# Altium schematic sheet 16B Sata Connectors.SchDoc
size 420 x 297 mm
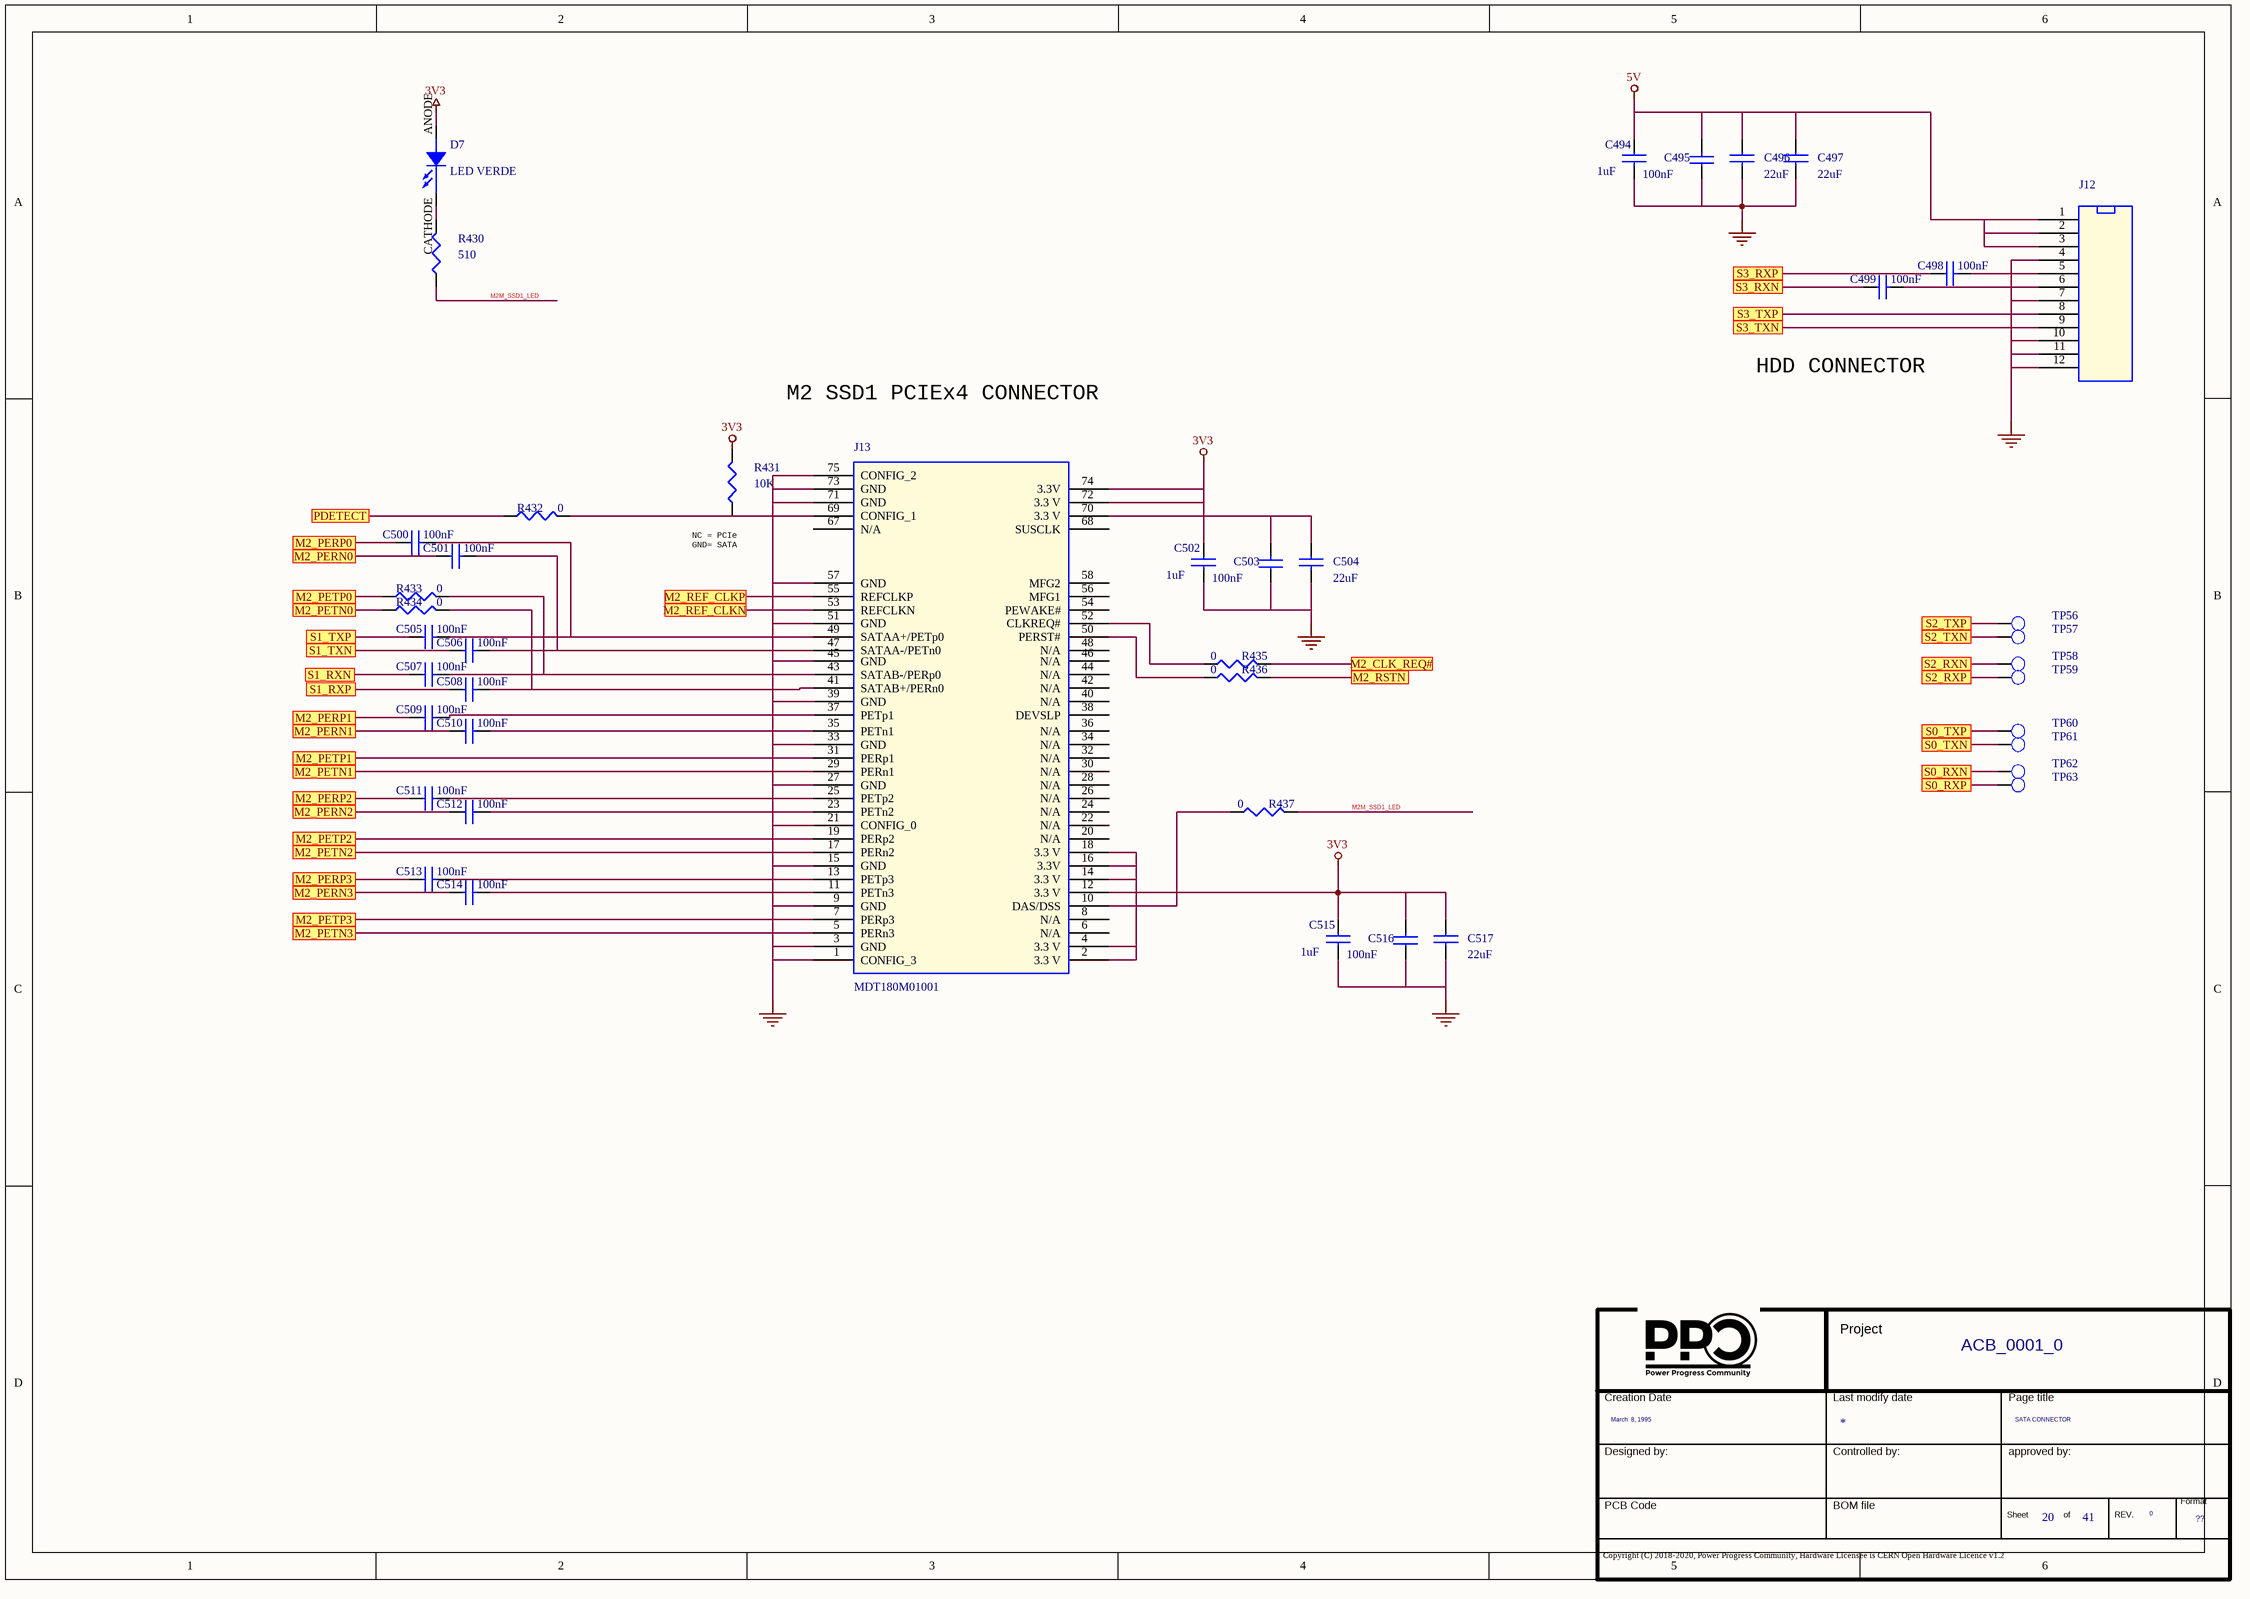
[diagram p0: 16B Sata Connectors.SchDoc]

## Parts
*  Page Count: 41  Page Create Date: March  8, 1995  Page Number: 20  Page Size: ??  Page Title: SATA CONNECTOR  RevCode: 0  Title: ACB_0001_0  (hidden comment: Title_block_PPC)  (graphical)
C494  1uF  [SMD_0402]
C495  100nF  [SMD_0402]
C496  22uF  [SMD_0805]
C497  22uF  [SMD_0805]
C498  100nF  [SMD_0402]
C499  100nF  [SMD_0402]
C500  100nF  [SMD_0402]
C501  100nF  [SMD_0402]
C502  1uF  [SMD_0402]
C503  100nF  [SMD_0402]
C504  22uF  [SMD_0805]
C505  100nF  [SMD_0402]
C506  100nF  [SMD_0402]
C507  100nF  [SMD_0402]
C508  100nF  [SMD_0402]
C509  100nF  [SMD_0402]
C510  100nF  [SMD_0402]
C511  100nF  [SMD_0402]
C512  100nF  [SMD_0402]
C513  100nF  [SMD_0402]
C514  100nF  [SMD_0402]
C515  1uF  [SMD_0402]
C516  100nF  [SMD_0402]
C517  22uF  [SMD_0805]
D7  LED VERDE  [led_0603]
J12  MCV 1,5/12-G-3,5  [SMD_2X50_P=0.635mm]  (value not drawn)
J13  MDT180M01001  [67 PIN PASSO 0.5mm]
R430  510  [SMD_0402]
R431  10K  [SMD_0402]
R432  0  [SMD_0402]
R433  0  [SMD_0402]
R434  0  [SMD_0402]
R435  0  [SMD_0402]
R436  0  [SMD_0402]
R437  0  [SMD_0402]
TP56  TEST POINT  [PCB]  (value not drawn)
TP57  TEST POINT  [PCB]  (value not drawn)
TP58  TEST POINT  [PCB]  (value not drawn)
TP59  TEST POINT  [PCB]  (value not drawn)
TP60  TEST POINT  [PCB]  (value not drawn)
TP61  TEST POINT  [PCB]  (value not drawn)
TP62  TEST POINT  [PCB]  (value not drawn)
TP63  TEST POINT  [PCB]  (value not drawn)

## Ports
M2_CLK_REQ#, M2_PERN0, M2_PERN1, M2_PERN2, M2_PERN3, M2_PERP0, M2_PERP1, M2_PERP2, M2_PERP3, M2_PETN0, M2_PETN1, M2_PETN2, M2_PETN3, M2_PETP0, M2_PETP1, M2_PETP2, M2_PETP3, M2_REF_CLKN, M2_REF_CLKP, M2_RSTN, PDETECT, S0_RXN, S0_RXP, S0_TXN, S0_TXP, S1_RXN, S1_RXP, S1_TXN, S1_TXP, S2_RXN, S2_RXP, S2_TXN, S2_TXP, S3_RXN, S3_RXP, S3_TXN, S3_TXP

## Nets
3V3: C502.1 C503.2 C504.1 C515.1 C516.2 C517.1 D7.ANODE J13.2(3.3_V) J13.4(3.3_V) J13.12(3.3_V) J13.14(3.3_V) J13.16(3.3V) J13.18(3.3_V) J13.70(3.3_V) J13.72(3.3_V) J13.74(3.3V) R431.1
5V: C494.1 C495.2 C496.1 C497.1 J12.1 J12.2 J12.3
GND: C494.2 C495.1 C496.2 C497.2 C502.2 C503.1 C504.2 C515.2 C516.1 C517.2 J12.4 J12.7 J12.10 J12.11 J12.12 J13.1(CONFIG_3) J13.3(GND) J13.9(GND) J13.15(GND) J13.21(CONFIG_0) J13.27(GND) J13.33(GND) J13.39(GND) J13.45(GND) J13.51(GND) J13.57(GND) J13.71(GND) J13.73(GND) J13.75(CONFIG_2)
M2_CLK_REQ#: R435.1 ; port M2_CLK_REQ#
M2_PERN0: C501.1 ; port M2_PERN0
M2_PERN1: C510.1 ; port M2_PERN1
M2_PERN2: C512.1 ; port M2_PERN2
M2_PERN3: C514.1 ; port M2_PERN3
M2_PERP0: C500.1 ; port M2_PERP0
M2_PERP1: C509.1 ; port M2_PERP1
M2_PERP2: C511.1 ; port M2_PERP2
M2_PERP3: C513.1 ; port M2_PERP3
M2_PETN0: R434.1 ; port M2_PETN0
M2_PETN1: J13.29(PERn1) ; port M2_PETN1
M2_PETN2: J13.17(PERn2) ; port M2_PETN2
M2_PETN3: J13.5(PERn3) ; port M2_PETN3
M2_PETP0: R433.1 ; port M2_PETP0
M2_PETP1: J13.31(PERp1) ; port M2_PETP1
M2_PETP2: J13.19(PERp2) ; port M2_PETP2
M2_PETP3: J13.7(PERp3) ; port M2_PETP3
M2_REF_CLKN: J13.53(REFCLKN) ; port M2_REF_CLKN
M2_REF_CLKP: J13.55(REFCLKP) ; port M2_REF_CLKP
M2_RSTN: R436.1 ; port M2_RSTN
M2M_SSD1_LED: R430.1 R437.1
PDETECT: R432.1 ; port PDETECT
S0_RXN: TP62.1(TP) ; port S0_RXN
S0_RXP: TP63.1(TP) ; port S0_RXP
S0_TXN: TP61.1(TP) ; port S0_TXN
S0_TXP: TP60.1(TP) ; port S0_TXP
S1_RXN: C507.1 ; port S1_RXN
S1_RXP: C508.1 ; port S1_RXP
S1_TXN: C506.1 ; port S1_TXN
S1_TXP: C505.1 ; port S1_TXP
S2_RXN: TP58.1(TP) ; port S2_RXN
S2_RXP: TP59.1(TP) ; port S2_RXP
S2_TXN: TP57.1(TP) ; port S2_TXN
S2_TXP: TP56.1(TP) ; port S2_TXP
S3_RXN: C499.1 ; port S3_RXN
S3_RXP: C498.1 ; port S3_RXP
S3_TXN: J12.9 ; port S3_TXN
S3_TXP: J12.8 ; port S3_TXP
NetC498_2: C498.2 J12.5
NetC499_2: C499.2 J12.6
NetC500_2: C500.2 C505.2 J13.49(SATAA+/PETp0)
NetC501_2: C501.2 C506.2 J13.47(SATAA-/PETn0)
NetC507_2: C507.2 J13.43(SATAB-/PERp0) R433.2
NetC508_2: C508.2 J13.41(SATAB+/PERn0) R434.2
NetC509_2: C509.2 J13.37(PETp1)
NetC510_2: C510.2 J13.35(PETn1)
NetC511_2: C511.2 J13.25(PETp2)
NetC512_2: C512.2 J13.23(PETn2)
NetC513_2: C513.2 J13.13(PETp3)
NetC514_2: C514.2 J13.11(PETn3)
NetD7_CATHODE: D7.CATHODE R430.2
NetJ13_10: J13.10(DAS/DSS) R437.2
NetJ13_50: J13.50(PERST#) R436.2
NetJ13_52: J13.52(CLKREQ#) R435.2
NetJ13_69: J13.69(CONFIG_1) R431.2 R432.2

Not connected (* = marked no-connect by the designer): J13 6(N/A) 8(N/A) 20(N/A) 22(N/A) 24(N/A) 26(N/A) 28(N/A) 30(N/A) 32(N/A) 34(N/A) 36(N/A) 38(DEVSLP) 40(N/A) 42(N/A) 44(N/A) 46(N/A) 48(N/A) 54(PEWAKE#) 56(MFG1) 58(MFG2) 67(N/A) 68(SUSCLK)

## Notes on the sheet
- HDD CONNECTOR
- M2 SSD1 PCIEx4 CONNECTOR
- (near R431) NC = PCIe
  GND= SATA
- (in symbol Title_block_PPC) Project; Creation Date; Last modify date; Page title; Designed by:; Controlled by:; approved by:; Format; PCB Code; BOM file; Sheet; of; REV.; Copyright (C) 2018-2020, Power Progress Community, Hardware Licensee is CERN Open Hardware Licence v1.2

## Library data of the parts
* = Title_block_PPC: Schematic Page Count: 45; Schematic Page Number: 22; Page Modify Date: *
C494 = CAP NP_Dup9: CAP CER 1UF 6.3V 10% X5R 0402 AUTOMOTIVE; Part Number: PASSIVE_49; Manufacturer 1: Taiyo Yuden; Manufacturer Part Number 1: JMK105BJ105KVHF; RSM: RC0402; PCB Footprint: SMD_0402; Part Type: Capacitors\Ceramic\SMD\0402; Distributor 1: DIGIKEY (587-3766-1-ND)
C495 C501 C506 C507 C510 C512 C514 = CAP NP_Dup9: COND.CER. 100NF 50V 0402 X7R SMD; Manufacturer Part Number 1: CGA2B3X7R1H104M050BD; Manufacturer 1: TDK; Part Number: PASSIVE_24; RSM: RC0402; PCB Footprint: SMD_0402; Distributor 1: MURATA ELETTRONICA SPA; Part Type: Capacitors\Ceramic\SMD\0402
C496 C497 C504 C517 = CAP NP_Dup2: 22UF 35V 20% 0805; Part Number: PASSIVE_224; Manufacturer 1: TDK; Manufacturer Part Number 1: C2012X5R1V226M125AC; RSM: RC0805; Part Type: Capacitors\Ceramic\SMD\0805; PCB Footprint: SMD_0805
C498-C500 C503 C505 C508 C509 C511 C513 C516 = CAP NP_Dup9: COND.CER. 100NF 50V 0402 X7R SMD; Part Number: PASSIVE_24; Manufacturer 1: TDK; Manufacturer Part Number 1: CGA2B3X7R1H104M050BD; RSM: RC0402; PCB Footprint: SMD_0402; Part Type: Capacitors\Ceramic\SMD\0402; Distributor 1: MURATA ELETTRONICA SPA
C502 C515 = CAP NP_Dup9: CAP CER 1UF 6.3V 10% X5R 0402 AUTOMOTIVE; Manufacturer Part Number 1: JMK105BJ105KVHF; Manufacturer 1: Taiyo Yuden; Part Number: PASSIVE_49; RSM: RC0402; Distributor 1: DIGIKEY (587-3766-1-ND); Part Type: Capacitors\Ceramic\SMD\0402; PCB Footprint: SMD_0402
D7 = LED_1: LED CHIPLED VERDE 40mcd 570nm; Manufacturer Part Number 1: 598-8070-107F; Manufacturer 1: DIALIGHT; Part Number: DISCRETE_31; PCB Footprint: SMD_0603; RSM: LED0603-AK; Distributor 1: MOUSER(645-598-8070-107F); Part Type: Diodes\LED; TYPE: LED
J12 = HEADER_12X1_Dup1: 12X1 3.5; PART NUMBER: CONNECTORS_31; Manufacturer 1: PHOENIX; RSM: PHOE-MCV-12-3_5; PCB Footprint: 12X1 3.5; Distributor 1: Samtec; Manufacturer Part Number 1: MCV 1,5/12-G-3,5; Part Type: B2W
J13 = M2_M_KEY: Connettori PCI Express/PCI 67P SMT RCPT H1.8 M Key; Manufacturer 1: AMPHENOL; Part Number: CONNECTORS_682; RSM: FCI-MDT180M01001; PCB Footprint: 67 PIN PASSO 0.5mm; Distributor 1: MOUSER(523-MDT180M01001); Manufacturer Part Number 1: MDT180M01001; Part Type: CON_M2
R430 = R_Dup5: RESIS.CHIP 510R 1% 0402 SMD; Part Number: PASSIVE_749; Manufacturer 1: ROYAL OHM; RSM: RC0402; Part Type: Resistors\Fixed\SMD\0402\1%; Manufacturer Part Number 1: RESIS.CHIP 510R 1% 0402 SMD; PCB Footprint: SMD_0402
R431 = R_Dup5: RESIS.CHIP 10K 1% 0402 SMD; Part Number: PASSIVE_584; Manufacturer 1: ROYAL OHM; RSM: RC0402; Part Type: Resistors\Fixed\SMD\0402\1%; PCB Footprint: SMD_0402; Manufacturer Part Number 1: RESIS.CHIP 10K 1% 0402 SMD
R432 = R_Dup8: RESIS.CHIP 0R 5% 0402 SMD; Manufacturer 1: ROYAL OHM; Part Number: PASSIVE_805; RSM: RC0402; Distributor 1: CAMEL ELETTRONICA SRL  #; Manufacturer Part Number 1: RESIS.CHIP 0R 5% 0402 SMD; Part Type: Resistors\Fixed\SMD\0402\5%; PCB Footprint: SMD_0402
R433-R437 = R_Dup8: RESIS.CHIP 0R 5% 0402 SMD; Part Number: PASSIVE_805; Manufacturer 1: ROYAL OHM; RSM: RC0402; Part Type: Resistors\Fixed\SMD\0402\5%; Manufacturer Part Number 1: RESIS.CHIP 0R 5% 0402 SMD; Distributor 1: CAMEL ELETTRONICA SRL  #; PCB Footprint: SMD_0402
TP56-TP63 = T POINT R_Dup1: TEST POINT SU PCB; Part Number: CONNECTORS_542; RSM: AE-TESTPOINT; PCB Footprint: PCB; Part Type: Tpoint